# EAGLE design RGB LED Board (EAGLE 6.5.0)
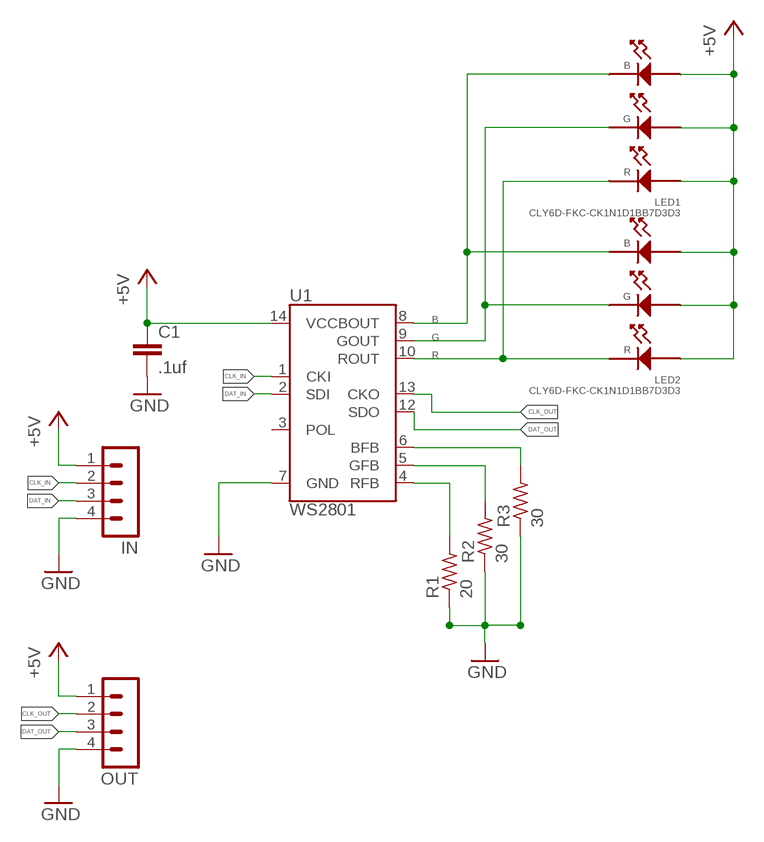
[diagram p0: schematic, sheet 1]

## Parts
C1  .1uf  CAP0805  [0805]
IN  MA04-1  [MA04-1]
LED1  CLY6D-FKC-CK1N1D1BB7D3D3  CLY6D-FKC  [CLY6D-FKC]
LED2  CLY6D-FKC-CK1N1D1BB7D3D3  CLY6D-FKC  [CLY6D-FKC]
OUT  MA04-1  [MA04-1]
R1  20  R-US_R0805  [R0805]
R2  30  R-US_R0805  [R0805]
R3  30  R-US_R0805  [R0805]
U1  WS2801  [SOP-14]

## Nets
+5V: C1.1 IN.1 LED1.P$4(ANODE_RED) LED1.P$5(ANODE_GREEN) LED1.P$6(ANODE_BLUE) LED2.P$4(ANODE_RED) LED2.P$5(ANODE_GREEN) LED2.P$6(ANODE_BLUE) OUT.1 U1.14(VCC)
B: LED1.P$1(CATHODE_BLUE) LED2.P$1(CATHODE_BLUE) U1.8(BOUT)
BFB: R3.2 U1.6(BFB)
CLK_IN: IN.2 U1.1(CKI)
CLK_OUT: OUT.2 U1.13(CKO)
DAT_IN: IN.3 U1.2(SDI)
DAT_OUT: OUT.3 U1.12(SDO)
G: LED1.P$2(CATHODE_GREEN) LED2.P$2(CATHODE_GREEN) U1.9(GOUT)
GFB: R2.2 U1.5(GFB)
GND: C1.2 IN.4 OUT.4 R1.1 R2.1 R3.1 U1.7(GND)
R: LED1.P$3(CATHODE_RED) LED2.P$3(CATHODE_RED) U1.10(ROUT)
RFB: R1.2 U1.4(RFB)
Unconnected: U1.3(POL)

## Library data of the parts
C1 = SparkFun-Capacitors:CAP: Capacitor Standard 0603 ceramic capacitor, and 0.1" leaded capacitor.
IN OUT = con-lstb:MA04-1: PIN HEADER; OC_FARNELL: unknown; OC_NEWARK: unknown
LED1 LED2 = PP_LED:CLY6D-FKC
R1-R3 = resistor:R-US_: RESISTOR, American symbol
U1 = SparkFun-DigitalIC:WS2801: WS2801 3 Channel Constant Current LED Driver with programmable PWM outputs. Datasheet: http://www.sparkfun.com/datasheets/Components/LED/WS2801.pdf

## Board
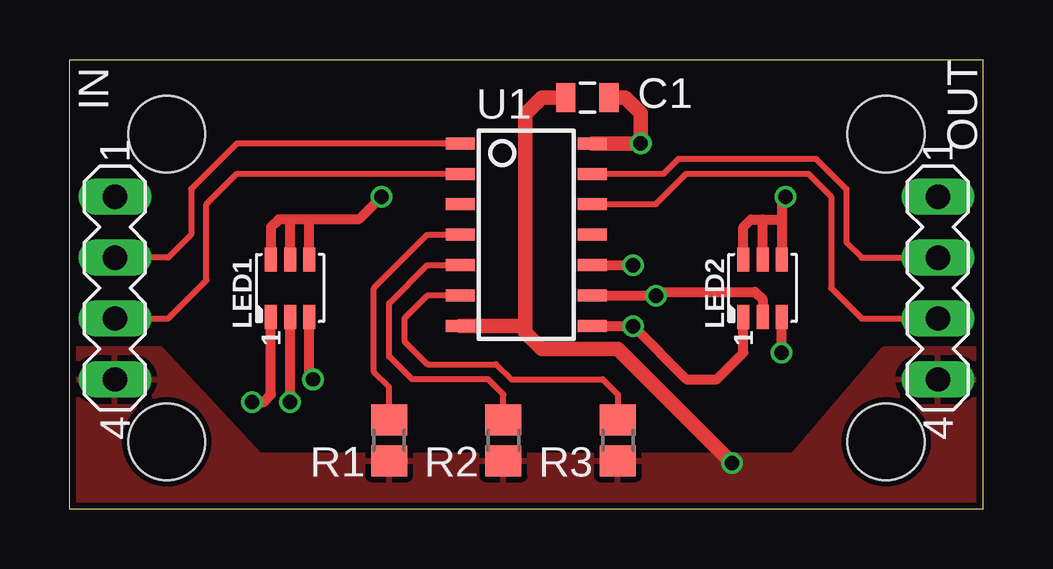
[diagram p1: board, top side]
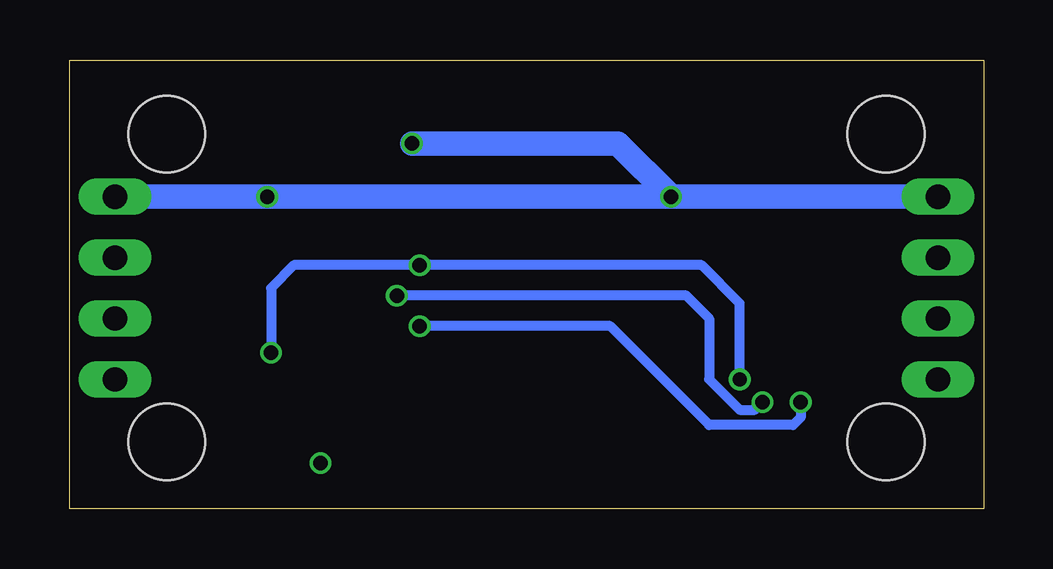
[diagram p2: board, bottom side, seen from below]

Size 38.08 x 18.72 mm. Coordinates in mm from the lower left corner, seen from the top.
Outline: 0,0 38.08,0 38.08,18.72 0,18.72 0,0
Copper layers (1*2*15*16): Top 0.035mm / dielectric 0.2mm / Route2 0.0175mm / dielectric 1.1mm / Route15 0.0175mm / dielectric 0.2mm / Bottom 0.035mm
Design rules "SeeedStudio_DRU_no_angle_20130527": minimum track width 6mil, minimum drill 12mil, track to track 6mil, track to pad 6mil, pad to pad 6mil, via to via 6mil, smd to smd 0mil, copper to edge 10mil, drill to drill 10mil, minimum pad ring 6mil, minimum via ring 6mil, stop-mask expansion 2mil, vias tented up to drill 25mil, thermal gap 10mil
Holes 3.2 mm at 4.06,15.62 34.04,15.62 34.04,2.79 4.06,2.79

### Footprints (pad centres in the part's own frame; a part is rotated, then mirrored left to right if it is on the bottom)
0805 = smd 0.8 x 1.2: 1 -0.9,0; 2 0.9,0
MA04-1 = drill 1.016 long: 1 -3.81,0; 2 -1.27,0; 3 1.27,0; 4 3.81,0
CLY6D-FKC = smd 1 x 0.5: P$1 -1.2,0.8; P$2 -1.2,0; P$3 -1.2,-0.8; P$4 1.2,-0.8; P$5 1.2,0; P$6 1.2,0.8
R0805 = smd 1.3 x 1.5: 1 -0.85,0; 2 0.85,0
SOP-14 = smd 0.5 x 1.2: 1 -3.81,-2.75; 2 -2.54,-2.75; 3 -1.27,-2.75; 4 0,-2.75; 5 1.27,-2.75; 6 2.54,-2.75; 7 3.81,-2.75; 8 3.81,2.75; 9 2.54,2.75; 10 1.27,2.75; 11 0,2.75; 12 -1.27,2.75; 13 -2.54,2.75; 14 -3.81,2.75

### Placement (x,y rotation side)
C1  21.59,17.14 180 top
IN  1.91,9.21 270 top
LED1  9.21,9.21 90 top
LED2  28.89,9.21 90 top
OUT  36.2,9.21 270 top
R1  13.34,2.86 90 top
R2  18.1,2.86 90 top
R3  22.86,2.86 90 top
U1  19.05,11.43 270 top

### Tracks (layer width: path | path; a pad name or v marks a point on that pad's centre or on a via)
+5V  (via drill 0.6)
  Top 0.406: v13.02,13.02 12.06,12.06 10.01,12.06 | 10.01,12.06 9.21,12.06 | 9.21,12.06 8.72,12.06 8.41,11.75 LED1.P$6 | LED1.P$5 9.21,12.06 | LED1.P$4 10.01,12.06 | v29.84,13.02 29.69,12.87 29.69,12.06 | 29.69,12.06 LED2.P$4 | LED2.P$5 28.89,12.06 | 28.89,12.06 29.69,12.06 | LED2.P$6 28.09,11.75 28.41,12.06 28.89,12.06
  Top 0.61: U1.14 v23.81,15.24 23.81,16.51 23.18,17.14 C1.1
  Bottom 1.016: IN.1 v13.02,13.02 | v13.02,13.02 25.4,13.02 v29.84,13.02 OUT.1 | v23.81,15.24 15.24,15.24 v13.02,13.02
B  (via drill 0.6)
  Top 0.406: U1.8 v23.5,7.62 25.72,5.4 26.99,5.4 28.09,6.5 LED2.P$1 | v7.62,4.45 8.09,4.45 8.41,4.76 LED1.P$1
  Bottom 0.406: v7.62,4.45 7.62,3.81 7.94,3.49 11.43,3.49 15.56,7.62 v23.5,7.62
BFB
  Top 0.254: U1.6 14.92,8.89 13.97,7.94 13.97,6.99 14.92,6.03 17.78,6.03 18.41,5.4 22.23,5.4 22.86,4.76 R3.2
CLK_IN
  Top 0.254: U1.1 6.99,15.24 5.08,13.34 5.08,11.43 4.13,10.48 IN.2
CLK_OUT
  Top 0.254: U1.13 24.77,13.97 25.4,14.61 31.11,14.61 32.38,13.34 32.38,11.11 33.02,10.48 OUT.2
DAT_IN
  Top 0.254: IN.3 4.13,7.94 5.71,9.53 5.71,12.7 6.99,13.97 U1.2
DAT_OUT
  Top 0.254: U1.12 24.45,12.7 25.72,13.97 30.8,13.97 31.75,13.02 31.75,9.21 33.02,7.94 OUT.3
G  (via drill 0.6)
  Top 0.406: U1.9 v24.45,8.89 24.61,9.05 28.57,9.05 28.89,8.73 LED2.P$2 | v9.21,4.45 LED1.P$2
  Bottom 0.406: v24.45,8.89 12.38,8.89 11.43,7.94 11.43,5.4 10.16,4.13 9.53,4.13 v9.21,4.45
GFB
  Top 0.254: R2.2 18.1,4.76 17.46,5.4 14.29,5.4 13.34,6.35 13.34,8.57 14.92,10.16 U1.5
GND  (via drill 0.6)
  Top 0.61: 19,7.62 19,12.7 19,16.46 19.68,17.14 C1.2 20.64,17.14 | 19,7.62 19,7.36 19.68,6.67 22.86,6.67 v27.62,1.91 | U1.7 19,7.62
  pour Top: -0.64,6.67 3.81,6.67 7.94,2.22 30.16,2.22 33.97,6.67 38.73,6.67 38.73,-0.32 -0.64,-0.32
R  (via drill 0.6)
  Top 0.406: U1.10 v23.5,10.16 | v10.16,5.4 10.01,5.55 LED1.P$3 | v29.69,6.51 LED2.P$3
  Bottom 0.406: v10.16,5.4 10.16,8.57 11.75,10.16 v23.5,10.16 28.73,10.16 29.69,9.21 v29.69,6.51
RFB
  Top 0.254: R1.2 13.34,5.08 12.7,5.71 12.7,9.21 14.92,11.43 U1.4